# Altium schematic sheet power.SchDoc
size A4; SheetNumber: 3; SheetTotal: 7
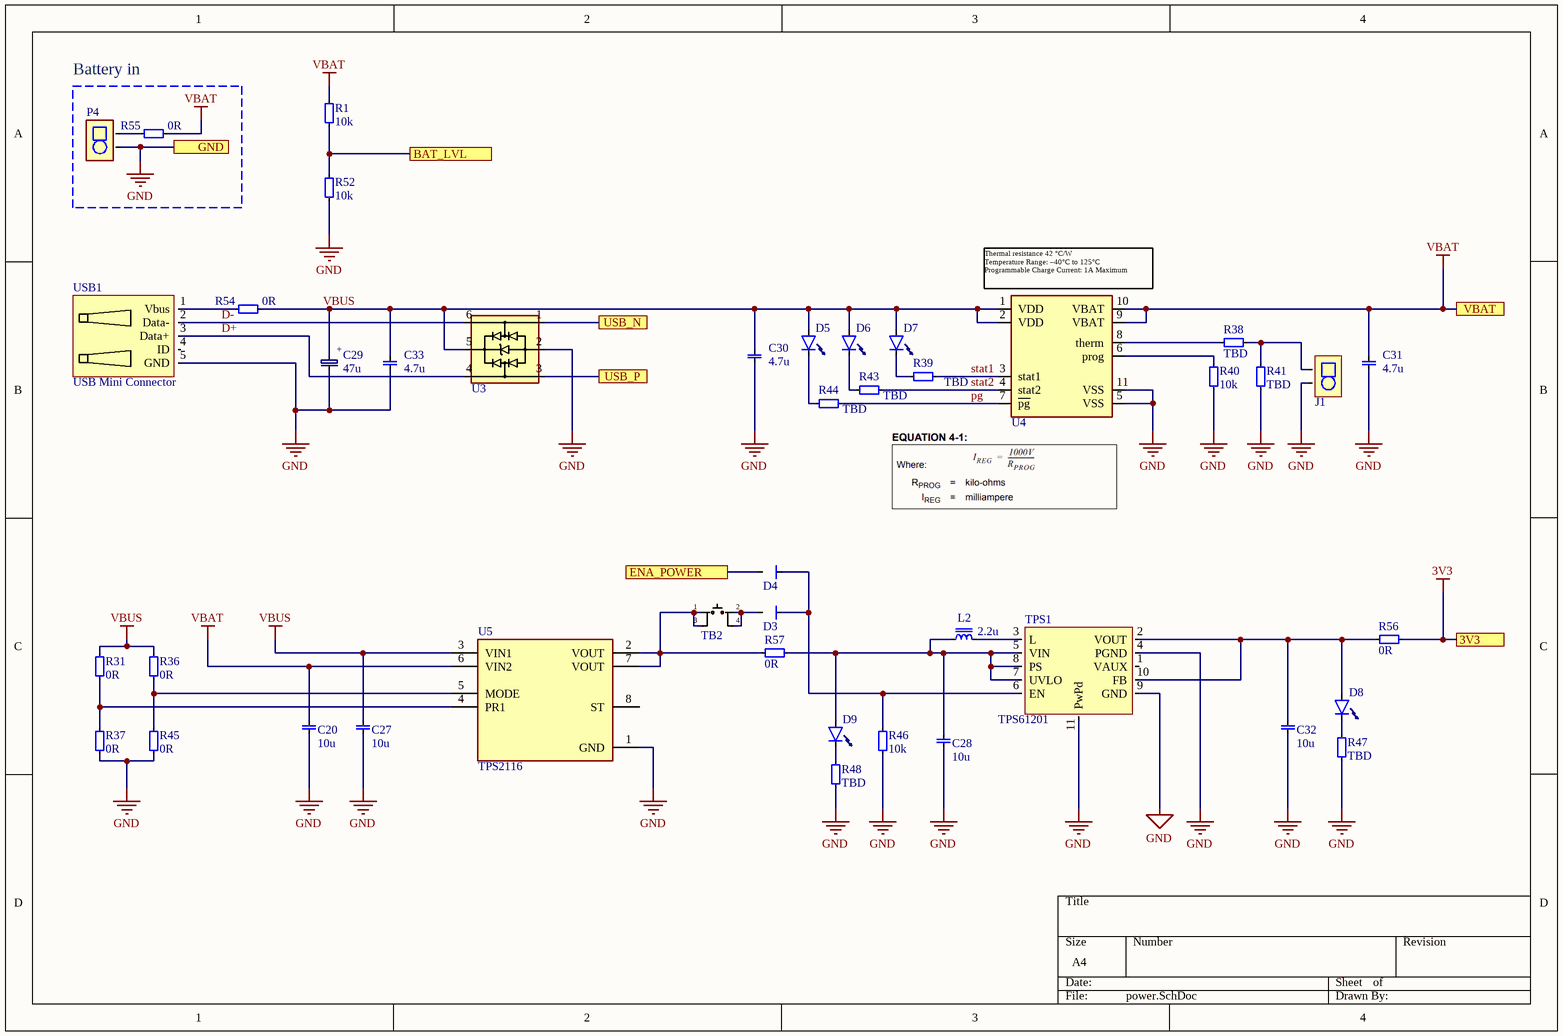
[diagram p0: power.SchDoc]

## Parts
C20  value 10u  [0402 CAP]  (hidden comment: 0402 capacitor)
C27  value 10u  [0402 CAP]  (hidden comment: 0402 capacitor)
C28  value 10u  [0402 CAP]  (hidden comment: 0402 capacitor)
C29  value 47u  [CASE_B]  (hidden comment: Cap, case B)
C30  value 4.7u  [0603 cap]  (hidden comment: 0603, capacitor)
C31  value 4.7u  [0603 cap]  (hidden comment: 0603, capacitor)
C32  value 10u  [0402 CAP]  (hidden comment: 0402 capacitor)
C33  value 4.7u  [0603 cap]  (hidden comment: 0603, capacitor)
D3  Diode, SMD  [SOD323]  (value not drawn)
D4  Diode, SMD  [SOD323]  (value not drawn)
D5  0603, LED  [0603 LED]  (value not drawn)
D6  0603, LED  [0603 LED]  (value not drawn)
D7  0603, LED  [0603 LED]  (value not drawn)
D8  0603, LED  [0603 LED]  (value not drawn)
D9  0603, LED  [0603 LED]  (value not drawn)
J1  Molex 0530480210  [MOLEX_0530480210]  (value not drawn)
L2  value 2.2u  [SRR4028]  (hidden comment: Coil, SRR4028)
P4  JST Connector  [JST_S2B-PH-K-S(LF)(SN)]  (value not drawn)
R1  value 10k  [0402 res]  (hidden comment: 0603, resistor)
R31  value 0R  [0402 res]  (hidden comment: 0603, resistor)
R36  value 0R  [0402 res]  (hidden comment: 0603, resistor)
R37  value 0R  [0402 res]  (hidden comment: 0603, resistor)
R38  value TBD  [0402 res]  (hidden comment: 0603, resistor)
R39  value TBD  [0402 res]  (hidden comment: 0603, resistor)
R40  value 10k  [0402 res]  (hidden comment: 0603, resistor)
R41  value TBD  [0402 res]  (hidden comment: 0603, resistor)
R43  value TBD  [0402 res]  (hidden comment: 0603, resistor)
R44  value TBD  [0402 res]  (hidden comment: 0603, resistor)
R45  value 0R  [0402 res]  (hidden comment: 0603, resistor)
R46  value 10k  [0402 res]  (hidden comment: 0603, resistor)
R47  value TBD  [0402 res]  (hidden comment: 0603, resistor)
R48  value TBD  [0402 res]  (hidden comment: 0603, resistor)
R52  value 10k  [0402 res]  (hidden comment: 0603, resistor)
R54  value 0R  [0603]  (hidden comment: 0603, resistor)
R55  value 0R  [0603]  (hidden comment: 0603, resistor)
R56  value 0R  [0603]  (hidden comment: 0603, resistor)
R57  value 0R  [0603]  (hidden comment: 0603, resistor)
TB2  Tactile Button  [tacButton smd]  (value not drawn)
TPS1  TPS61201  [PSON10N]
U3  USBLC6-2  [SOT236]  (value not drawn)
U4  MCP73833/4  [DFN10]  (value not drawn)
U5  TPS2116  [SOTFL50P160X60-8N]
USB1  USB Mini Connector  [USB Mini TH]

## Blocks framed on the sheet
Battery in: P4 R55

## Ports
3V3, BAT_LVL, ENA_POWER, GND, USB_N, USB_P, VBAT

## Nets
3V3: R56.0 ; port 3V3
GND: C20.0 C27.0 C28.0 C29.1 C30.0 C31.0 C32.0 C33.0 J1.2 P4.2 R37.0 R40.0 R41.0 R45.0 R46.0 R47.1 R48.1 R52.1 TPS1.4(PGND) TPS1.9(GND) TPS1.11(PwPd) U3.2 U4.5(VSS) U4.11(VSS) U5.1(GND) USB1.5(GND) ; port GND
VBAT: C20.1 C31.1 R1.0 R55.0 U4.9(VBAT) U4.10(VBAT) U5.6(VIN2) ; port VBAT
VBUS: C27.1 C29.2 C30.1 C33.1 D5.1 D6.1 D7.1 R31.1 R36.1 R54.0 U3.5 U4.1(VDD) U4.2(VDD) U5.3(VIN1)
BAT_LVL: R1.1 R52.0 ; port BAT_LVL
D+: U3.4 USB1.3(Data+)
D-: U3.6 USB1.2(Data-)
ENA_POWER: D4.2 ; port ENA_POWER
~{pg}: R44.1 U4.7(~{pg})
stat1: R39.1 U4.3(stat1)
stat2: R43.1 U4.4(stat2)
USB_N: U3.1 ; port USB_N
USB_P: U3.3 ; port USB_P
NetC28_1: C28.1 D9.1 L2.2 R57.0 TPS1.5(VIN) TPS1.7(UVLO) TPS1.8(PS)
NetC32_1: C32.1 D8.1 R56.1 TPS1.2(VOUT) TPS1.10(FB)
NetD3_1: D3.1 D4.1 R46.1 TPS1.6(EN)
NetD3_2: D3.2 TB2.2 TB2.4
NetD5_0: D5.0(Cathode) R44.0
NetD6_0: D6.0(Cathode) R43.0
NetD7_0: D7.0(Cathode) R39.0
NetD8_0: D8.0(Cathode) R47.0
NetD9_0: D9.0(Cathode) R48.0
NetJ1_1: J1.1 R38.0 R41.1
NetL2_1: L2.1 TPS1.3(L)
NetP4_1: P4.1 R55.1
NetR31_0: R31.0 R37.1 U5.4(PR1)
NetR36_0: R36.0 R45.1 U5.5(MODE)
NetR38_1: R38.1 U4.8(therm)
NetR40_1: R40.1 U4.6(prog)
NetR54_1: R54.1 USB1.1(Vbus)
NetR57_1: R57.1 TB2.1 TB2.3 U5.2(VOUT) U5.7(VOUT)

Not connected (* = marked no-connect by the designer): TPS1 1(VAUX); U5 8(ST); USB1 4(ID)

## Notes on the sheet
- (near U4) Thermal resistance 42 °C/W
  Temperature Range: –40°C to 125°C
  Programmable Charge Current: 1A Maximum
- (in symbol Cap, case B) +

## Library data of the parts
C20 C27 C28 C32 = 0402 capacitor: Manufacturer Part No: GRM155R61A106ME11D
C29 = Cap, case B: Manufacturer Part No: TAJB476M010RNJ
C30 C31 C33 = 0603, capacitor: Manufacturer Part No: GRM188C81C475KE11D; Order number: *
D3 D4 = Diode, SMD: Manufacturer Part No: CUS05S30H3FCT-ND
D5 D8 D9 = 0603, LED: Manufacturer Part No: 5988081107F
D6 D7 = 0603, LED: Manufacturer Part No: 150060SS75003
J1 = Molex 0530480210: PicoBlade Header R/A, 1.25 mm,; Manufacturer Part No: 0530480210
L2 = Coil, SRR4028: 2,2µH, 2.0 A, 28 mOhm; Manufacturer Part No: SRR4028-2R2Y; Digikey: SRR4028-2R2YCT-ND
P4 = JST Connector: Connector Header Through Hole, Right Angle 2 position; Manufacturer Part No: S2B-PH-K-S
R1 R52 = 0603, resistor: 311-10.0KLRCT-ND; Manufacturer Part No: 311-10.0KLRCT-ND
R31 R36 R37 R45 = 0603, resistor: Manufacturer Part No: RMCF0402ZT0R00
R40 R46 = 0603, resistor: Manufacturer Part No: 311-10.0KLRCT-ND
R54-R57 = 0603, resistor: Manufacturer Part No: 541-0.0GCT-ND
TB2 = TacButton SMD: Tactile Switch Small Low; Manufacturer Part No: 430182043816; Value: Button SMD
TPS1 = TPS6120x: TPS6120x Low Input Voltage Synchronous Boost Converter; Manufacturer Part No: TPS61201DRCR; Value: TPS61200; DigiKey: 296-27017-1-ND
U3 = USBLC6-2: Very low capacitance 2 data-line and VBUS ESD protection; Manufacturer Part No: USBLC6-2SC6; Order number: 497-5235-1-ND; Value: Anti_esd; Supplier: Digikey
U4 = MCP73833/4: Stand-Alone Linear Li-Ion / Li-Polymer Charge / Management Controller; Manufacturer Part No: MCP73833-NVI/MF; Supplier: *; Order number: *
U5 = TPS2116: 1.6 V to 5.5 V, 2.5-A Low IQ Power Mux with Manual and Priority Switchover; Manufacturer Part No: TPS2116DRLR
USB1 = USB Mini Connector: Manufacturer Part No: XM7D-0512; Value: USB Mini Connector; Farnell: 1125348